# Altium schematic sheet RADIO.SchDoc
size A4; SheetNumber: 7; SheetTotal: 9
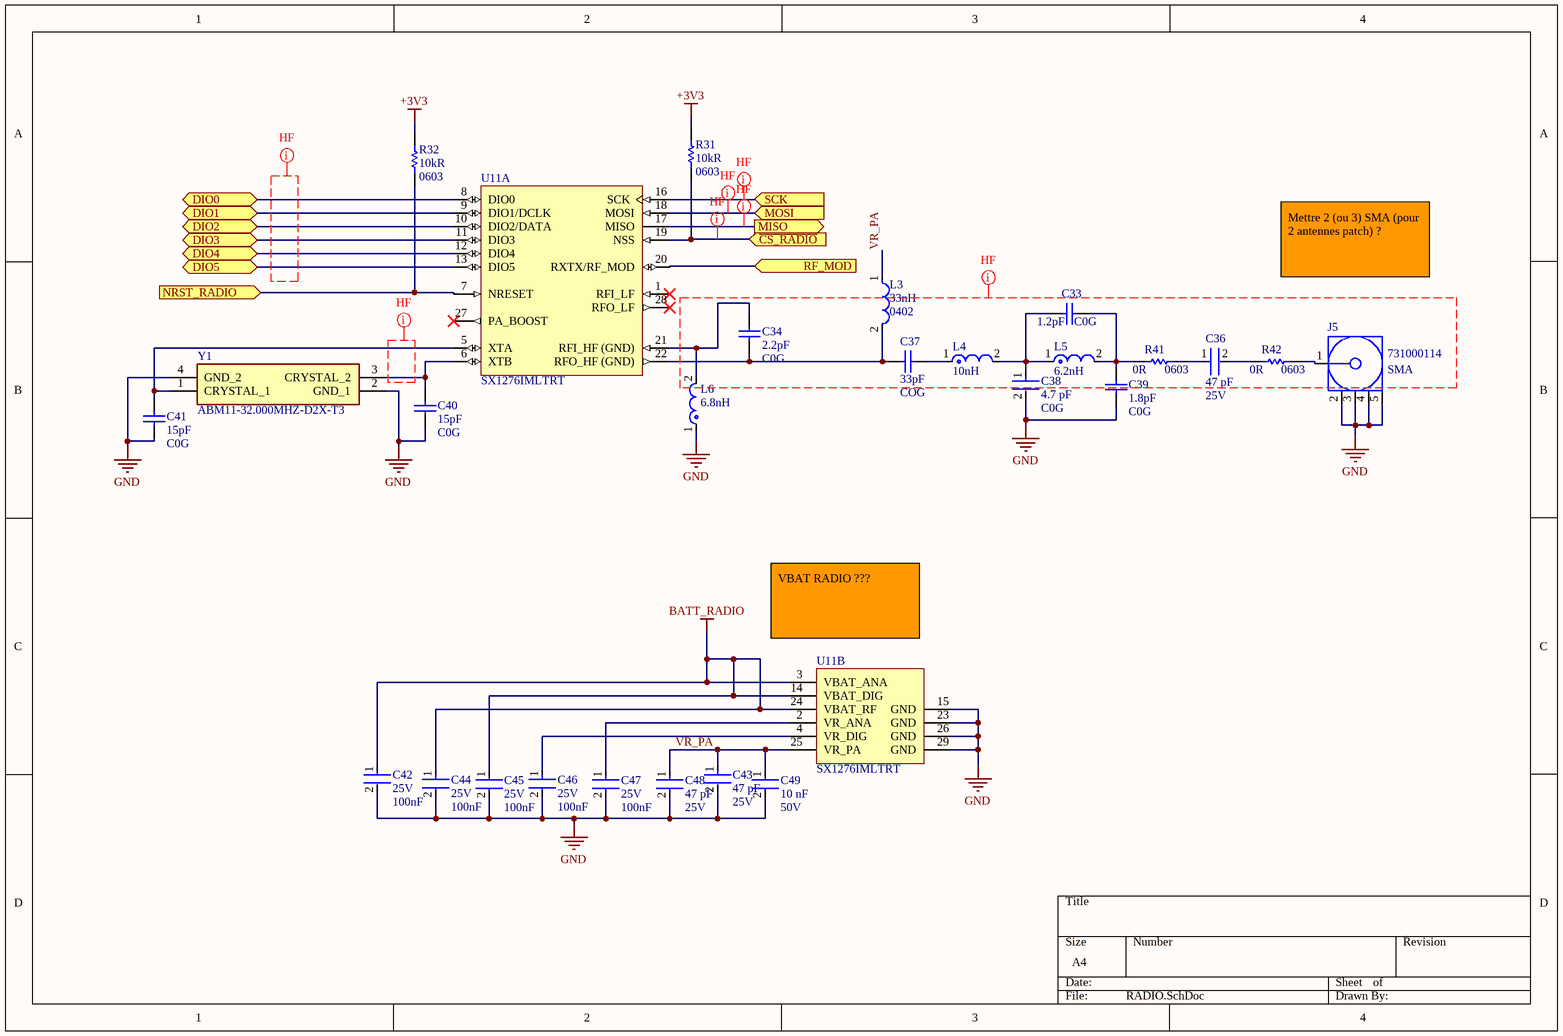
[diagram p0: RADIO.SchDoc]

## Parts
C33  Capacitance: 1.2pF  Dielectric: C0G  [CAPC1508X91X25LL25T13]  (hidden comment: 06032U1R2BAT2A)
C34  Capacitance: 2.2pF  Dielectric: C0G  [CAPC1005X56X25ML10T15]  (hidden comment: 04023A2R2CAT2A)
C36  Capacitance: 47 pF  Voltage Rating (DC): 25V  [FP-C0603C-CF-MFG]  (hidden comment: C0603C470J3GACTU)
C37  Capacitance: 33pF  Temperature Coefficient: COG  [CAPC1608X90X40LL10T20]  (hidden comment: CC0603JRNPO9BN330)
C38  Capacitance: 4.7 pF  Temperature Characteristic: C0G  [FP-C0603C-CF-MFG]  (hidden comment: C0603C479C5GACTU)
C39  Capacitance: 1.8pF  Dielectric: C0G  [CAPC1508X91X25NL25T13]  (hidden comment: 06032U1R8BAT2A)
C40  Capacitance: 15pF  Dielectric: C0G  [CAPC1608X92X38ML15T08]  (hidden comment: VJ0603D150JXPAJ)
C41  Capacitance: 15pF  Dielectric: C0G  [CAPC1608X92X38ML15T08]  (hidden comment: VJ0603D150JXPAJ)
C42  Voltage Rating (DC): 25V  Capacitance: 100nF  [FP-CGA3E-0_3-0_1-MFG]  (hidden comment: CGA3E2X7R1E104K080AA)
C43  Capacitance: 47 pF  Voltage Rating (DC): 25V  [FP-C0603C-CF-MFG]  (hidden comment: C0603C470J3GACTU)
C44  Voltage Rating (DC): 25V  Capacitance: 100nF  [FP-CGA3E-0_3-0_1-MFG]  (hidden comment: CGA3E2X7R1E104K080AA)
C45  Voltage Rating (DC): 25V  Capacitance: 100nF  [FP-CGA3E-0_3-0_1-MFG]  (hidden comment: CGA3E2X7R1E104K080AA)
C46  Voltage Rating (DC): 25V  Capacitance: 100nF  [FP-CGA3E-0_3-0_1-MFG]  (hidden comment: CGA3E2X7R1E104K080AA)
C47  Voltage Rating (DC): 25V  Capacitance: 100nF  [FP-CGA3E-0_3-0_1-MFG]  (hidden comment: CGA3E2X7R1E104K080AA)
C48  Capacitance: 47 pF  Voltage Rating (DC): 25V  [FP-C0603C-CF-MFG]  (hidden comment: C0603C470J3GACTU)
C49  Capacitance: 10 nF  Voltage Rating (DC): 50V  [FP-CC0603-DA-MFG]  (hidden comment: CC0603KRX7R9BB103)
J5  731000114  Case/Package: SMA  [MOLX-731000114_V]
L3  Inductance: 33nH  Case/Package: 0402  [FP-LQW15AN_00-W0_5-0_1-MFG]  (hidden comment: LQW15AN33NJ00D)
L4  Inductance: 10nH  [FP-LQG15HH_02-IPC_A]  (hidden comment: LQG15HS10NJ02D)
L5  Inductance: 6.2nH  [FP-LQG15HH_02-IPC_C]  (hidden comment: LQG15HS6N2S02D)
L6  Inductance: 6.8nH  [FP-LQG15HH_02-IPC_A]  (hidden comment: LQG15HS6N8J02D)
R31  Resistance: 10kR  Case Code (Imperial): 0603  [RESC1609X55X30LL15T15]  (hidden comment: ERJ3EKF1002V)
R32  Resistance: 10kR  Case Code (Imperial): 0603  [RESC1609X55X30LL15T15]  (hidden comment: ERJ3EKF1002V)
R41  Case Code (Imperial): 0603  Resistance: 0R  [RESC1608X55X25ML10T15]  (hidden comment: RC0603JR-070RL)
R42  Case Code (Imperial): 0603  Resistance: 0R  [RESC1608X55X25ML10T15]  (hidden comment: RC0603JR-070RL)
U11  SX1276IMLTRT  [SMTC-QFN-28_V]  (parts A,B of 2)
Y1  ABM11-32.000MHZ-D2X-T3  [ABM1132000MHZD2XT3]

## Ports
DIO0 (bidir), DIO1 (bidir), DIO2 (bidir), DIO3 (bidir), DIO4 (bidir), DIO5 (bidir), MISO (out), MOSI (in), NRST_RADIO (in), RF_MOD (in), SCK (in), ~{CS_RADIO} (in)

## Nets
+3V3: R31.2 R32.2
BATT_RADIO: C42.1 C44.1 C45.1 U11.3(VBAT_ANA) U11.14(VBAT_DIG) U11.24(VBAT_RF)
GND: C38.2 C39.1 C40.1 C41.1 C42.2 C43.2 C44.2 C45.2 C46.2 C47.2 C48.2 C49.2 J5.2 J5.3 J5.4 J5.5 L6.1 U11.15(GND) U11.23(GND) U11.26(GND) U11.29(GND) Y1.2(GND_1) Y1.4(GND_2)
~{CS_RADIO}: R31.1 U11.19(NSS) ; port ~{CS_RADIO}
DIO0: U11.8(DIO0) ; port DIO0
DIO1: U11.9(DIO1/DCLK) ; port DIO1
DIO2: U11.10(DIO2/DATA) ; port DIO2
DIO3: U11.11(DIO3) ; port DIO3
DIO4: U11.12(DIO4) ; port DIO4
DIO5: U11.13(DIO5) ; port DIO5
MISO: U11.17(MISO) ; port MISO
MOSI: U11.18(MOSI) ; port MOSI
NRST_RADIO: R32.1 U11.7(NRESET) ; port NRST_RADIO
RF_MOD: U11.20(RXTX/RF_MOD) ; port RF_MOD
SCK: U11.16(SCK) ; port SCK
VR_PA: C43.1 C48.1 C49.1 L3.1 U11.25(VR_PA)
NetC33_1: C33.1 C38.1 L4.2 L5.1
NetC33_2: C33.2 C39.2 L5.2 R41.1
NetC34_1: C34.1 L6.2 U11.21(RFI_HF_(GND))
NetC34_2: C34.2 C37.2 L3.2 U11.22(RFO_HF_(GND))
NetC36_1: C36.1 R41.2
NetC36_2: C36.2 R42.1
NetC37_1: C37.1 L4.1
NetC40_2: C40.2 U11.6(XTB) Y1.3(CRYSTAL_2)
NetC41_2: C41.2 U11.5(XTA) Y1.1(CRYSTAL_1)
NetC46_1: C46.1 U11.4(VR_DIG)
NetC47_1: C47.1 U11.2(VR_ANA)
NetJ5_1: J5.1 R42.2

Not connected (* = marked no-connect by the designer): U11 1(RFI_LF)* 27(PA_BOOST)* 28(RFO_LF)*

## Layout directives
net class HF: (no net found under the mark), MISO, MOSI, SCK, ~{CS_RADIO}

## Notes on the sheet
- Mettre 2 (ou 3) SMA (pour 2 antennes patch) ?
- (near U11) VBAT RADIO ???

## Library data of the parts
C33 = CMP-2006-04663-1: Manufacturer: AVX Interconnect / Elco; Dielectric Material: Ceramic; Voltage Rating: 200V; Temperature Coefficient: 30ppm/°C; Tolerance: 2%; Part Number: 06032U1R2BAT2A; Supplier 1: Mouser; Supplier Part Number 1: 581-06032U1R2BAT2A; Manufacturer Part Number: 06032U1R2BAT2A; RoHS: Yes; Category: Ceramic Capacitors; Stock 1: 554; Pricing 1: 1=0,38000, 10=0,26500, 50=0,26500, 100=0,15000, 500=0,11000, 1000=0,09700, 4000=0,08200, 8000=0,06700, 10000=0,06700 (USD); Mount: Surface Mount; Case/Package: 0603; Case Code (Imperial): 0603; Case Code (Metric): 1608; Contact Plating: Tin,Matte; Min Operating Temperature: -55°C; Max Operating Temperature: 125°C; Voltage Rating (DC): 200V; Packaging: Tape and Reel; Package Quantity: 4000; Termination: SMD/SMT; Series: U; Construction: Flat; Voltage: 200V; Resistor Type: Ceramic; Length: 1.52mm; Width: 0.81mm; Height: 0.91mm; Thickness: 0.036inch; Depth: 0.76mm; Radiation Hardening: No; RoHS Compliant: Yes; REACH SVHC: No SVHC; Lead Free: Lead Free; ComponentLink1URL: https://datasheet.ciiva.com/26939/getdatasheetpartid-777450-26939684.pdf?src-supplier=Verical; ComponentLink1Description: https://datasheet.ciiva.com/26939/getdatasheetpartid-777450-26939684.pdf?src-supplier=Verical; ComponentLink2URL: https://datasheet.ciiva.com/11787/0900766b80def273-11787231.pdf?src-supplier=RSComponents; ComponentLink2Description: https://datasheet.ciiva.com/11787/0900766b80def273-11787231.pdf?src-supplier=RSComponents; ComponentLink3URL: https://datasheet.ciiva.com/11573/useries-11573174.pdf?src-supplier=Avnet; ComponentLink3Description: https://datasheet.ciiva.com/11573/useries-11573174.pdf?src-supplier=Avnet; ComponentLink4URL: https://datasheet.ciiva.com/17489/useries-17489479.pdf?src-supplier=Avnet+Europe; ComponentLink4Description: https://datasheet.ciiva.com/17489/useries-17489479.pdf?src-supplier=Avnet+Europe; ComponentLink5URL: https://datasheet.ciiva.com/1124/319610-1124475.pdf?src-supplier=Element14; ComponentLink5Description: https://datasheet.ciiva.com/1124/319610-1124475.pdf?src-supplier=Element14; ComponentLink6URL: https://datasheet.ciiva.com/16327/useries-16327211.pdf?src-supplier=Future+Electronics; ComponentLink6Description: https://datasheet.ciiva.com/16327/useries-16327211.pdf?src-supplier=Future+Electronics; ComponentLink7URL: https://datasheet.ciiva.com/1124/319610-1124476.pdf?src-supplier=Element14; ComponentLink7Description: https://datasheet.ciiva.com/1124/319610-1124476.pdf?src-supplier=Element14; ComponentLink8URL: https://datasheet.ciiva.com/207/useries-207423.pdf?src-supplier=Digi-Key; ComponentLink8Description: https://datasheet.ciiva.com/207/useries-207423.pdf?src-supplier=Digi-Key
C34 = CMP-2008-02490-1: Manufacturer: AVX Interconnect / Elco; Voltage Rating: 25V; Part Number: 04023A2R2CAT2A; Supplier 1: Mouser; Supplier Part Number 1: 581-04023A2R2CAT2A; Manufacturer Part Number: 04023A2R2CAT2A; RoHS: Yes; Category: Ceramic Capacitors; Stock 1: 6118; Pricing 1: 1=0,32000, 10=0,22700, 50=0,22700, 100=0,12800, 1000=0,08700, 10000=0,05700 (USD); Mount: Surface Mount; Case/Package: 0402; Case Code (Metric): 1005; Case Code (Imperial): 0402; Min Operating Temperature: -55°C; Max Operating Temperature: 125°C; Packaging: Tape and Reel; Package Quantity: 10000; Voltage Rating (DC): 25V; Termination: SMD/SMT; Series: -; Construction: Flat; Length: 1mm; Width: 0.02inch; Thickness: 0.022inch; Depth: 0.5mm; Radiation Hardening: No; RoHS Compliant: Yes; Lead Free: Lead Free; ComponentLink1URL: https://datasheet.ciiva.com/206/ccog-206373.pdf?src-supplier=Digi-Key; ComponentLink1Description: https://datasheet.ciiva.com/206/ccog-206373.pdf?src-supplier=Digi-Key; ComponentLink2URL: https://datasheet.ciiva.com/5447/ccog-243403-5447334.pdf?src-supplier=Mouser; ComponentLink2Description: https://datasheet.ciiva.com/5447/ccog-243403-5447334.pdf?src-supplier=Mouser; ComponentLink3URL: https://datasheet.ciiva.com/11572/ccog-11572039.pdf?src-supplier=Avnet; ComponentLink3Description: https://datasheet.ciiva.com/11572/ccog-11572039.pdf?src-supplier=Avnet
C36 C43 C48 = CMP-2006-03632-2: CAP CER 47PF 25V 5% NP0 0603; Manufacturer: KEMET; Temperature Characteristic: C0G; Temperature Coefficient: 30ppm/°C; Automotive Grade: Grade 1; Material: Ceramic; Tolerance: 0.05; Dissipation Factor: 0.1%; Height: 0.87mm; Category: Cap; Value: 47 pF; Temperature Range Low: -55°C; ComponentLink2Description: Datasheet; Temperature: -55°C to +125°C; RoHS: TRUE; Device Class L2: Capacitors; Manufacturer Part Number: C0603C470J3GACTU; Device Class L1: Passive Components; Automotive: Yes; Digikey Description: CAP CER 47PF 25V 5% NP0 0603; Temperature Range High: +125°C; Package: C0603C-CF; Device Class L3: Ceramic Capacitors; Octopart: https://octopart.com/c0603c470j3gactu-kemet-8375742; Voltage Rating: 25 V; Lead Free: Yes; Mouser Description: Multilayer Ceramic Capacitors MLCC - SMD/SMT 25volts 47pF C0G 5%; ComponentLink2URL: https://api.kemet.com/component-edge/download/datasheet/C0603C100J5GACAUTO.pdf; Supplier 1: Mouser; Supplier Part Number 1: 80-C0603C470J3G; Stock 1: 20028; Pricing 1: 1=0,25000, 10=0,13100, 50=0,13100, 100=0,07800, 1000=0,06100, 10000=0,04800 (USD); Mount: Surface Mount; Case/Package: 0603; Case Code (Metric): 1608; Case Code (Imperial): 0603; Dielectric Material: Ceramic; Min Operating Temperature: -55°C; Max Operating Temperature: 125°C; Package Quantity: 1; Packaging: Tape and Reel; Dielectric: C0G; Termination: SMD/SMT; Series: C; Construction: Flat; Length: 1.6mm; Width: 0.031inch; Thickness: 0.034inch; Depth: 0.8mm; Lead Pitch: 0.7mm; Radiation Hardening: No; RoHS Compliant: Yes; REACH SVHC: No SVHC; ComponentLink1URL: https://datasheet.ciiva.com/5417/kem-c1003-c0g-smd-356956-5417785.pdf?src-supplier=Mouser; ComponentLink1Description: https://datasheet.ciiva.com/5417/kem-c1003-c0g-smd-356956-5417785.pdf?src-supplier=Mouser; ComponentLink3URL: https://datasheet.ciiva.com/11646/kem-c1003-c0g-smd-11646191.pdf?src-supplier=Avnet; ComponentLink3Description: https://datasheet.ciiva.com/11646/kem-c1003-c0g-smd-11646191.pdf?src-supplier=Avnet
C37 = CMP-2000-06072-1: Chip Capacitor, 33 pF, +/- 5%, 50 V, -55 to 125 degC, 0603 (1608 Metric), RoHS, Tape and Reel; Manufacturer: Yageo; Product Training Modules: MultilayerCeramicCapacitors; Voltage - Rated: 50V; Featured Product: CommodityMultilayerCeramicCapacitors–CCSeries; Other Names: 0603CG330J9B200223886715339223886715339311-1064-2311-1282-2311-1282-2-NDCC0603JRNP09BN330BCC0603JRNPO9BN330B; Online Catalog: CCSeries; Dielectric Material: Ceramic; Dielectric: C0G; Insulation Resistance: 100GR; Operating Temperature: -55°C~125°C; Thickness (Max): 0.035"(0.90mm); Size / Dimension: 0.063"Lx0.031"W(1.60mmx0.80mm); Lead Spacing: -; Mounting Type: SurfaceMount,MLCC; Tolerance: ±5%; Standard Package: 4,000; Mounting Technology: SurfaceMount; Ratings: -; Applications: GeneralPurpose; Height - Seated (Max): -; Packaging: Tape&Reel(TR); Series: CC; Package / Case: 0603(1608Metric); Package Description: 2-Pin Surface Mount Device, Body 1.6 x 0.8 mm; Manufacturer URL: http://www.yageo.com/; Family: CeramicCapacitors; Package Reference: 0603; Category: Capacitors; Datasheet Version: Rev. 14, 07/2016; Datasheet URL: http://www.yageo.com/NewPortal/yageodocoutput?fileName=/pdf/MLCC/UPY-GP_NP0_16V-to-50V_14.pdf; Features: -; Lead Style: -; Supplier 1: Mouser; Supplier Part Number 1: 603-C0603JRNPO9BN330; Manufacturer Part Number: CC0603JRNPO9BN330; RoHS: Yes; Stock 1: 34053; Pricing 1: 1=0,10000, 10=0,05700, 50=0,05700, 100=0,02500, 500=0,01900, 1000=0,01500, 4000=0,01200, 8000=0,01000, 10000=0,01000 (USD); Mount: Surface Mount; Case/Package: 0603; Number of Pins: 2; Case Code (Metric): 1608; Case Code (Imperial): 0603; Min Operating Temperature: -55°C; Max Operating Temperature: 125°C; Voltage Rating: 50V; Package Quantity: 1; Voltage Rating (DC): 50V; Termination: SMD/SMT; Voltage: 50V; Resistor Type: Ceramic; Length: 1.6mm; Width: 0.031inch; Height: 0.8mm; Thickness: 0.035inch; Depth: 0.8mm; Radiation Hardening: No; REACH SVHC: No SVHC; Lead Free: Lead Free; RoHS Compliant: Yes; ComponentLink1URL: https://datasheet.ciiva.com/11786/0900766b8079c870-11786082.pdf?src-supplier=RSComponents; ComponentLink1Description: https://datasheet.ciiva.com/11786/0900766b8079c870-11786082.pdf?src-supplier=RSComponents; ComponentLink2URL: https://datasheet.ciiva.com/26862/getdatasheetpartid-403532-26862767.pdf?src-supplier=Verical; ComponentLink2Description: https://datasheet.ciiva.com/26862/getdatasheetpartid-403532-26862767.pdf?src-supplier=Verical; ComponentLink3URL: https://datasheet.ciiva.com/144/mlccorderingcode-144643.pdf?src-supplier=Digi-Key; ComponentLink3Description: https://datasheet.ciiva.com/144/mlccorderingcode-144643.pdf?src-supplier=Digi-Key; ComponentLink4URL: https://datasheet.ciiva.com/144/mlccorderingcode-144644.pdf?src-supplier=Digi-Key; ComponentLink4Description: https://datasheet.ciiva.com/144/mlccorderingcode-144644.pdf?src-supplier=Digi-Key; ComponentLink5URL: https://datasheet.ciiva.com/144/mlccorderingcode-144645.pdf?src-supplier=Digi-Key; ComponentLink5Description: https://datasheet.ciiva.com/144/mlccorderingcode-144645.pdf?src-supplier=Digi-Key; ComponentLink6URL: https://datasheet.ciiva.com/5426/upy-gp-np0-16v-to-50v-8-5426614.pdf?src-supplier=Mouser; ComponentLink6Description: https://datasheet.ciiva.com/5426/upy-gp-np0-16v-to-50v-8-5426614.pdf?src-supplier=Mouser; ComponentLink7URL: https://datasheet.ciiva.com/8033/1372269-8033734.pdf?src-supplier=Element14; ComponentLink7Description: https://datasheet.ciiva.com/8033/1372269-8033734.pdf?src-supplier=Element14; ComponentLink8URL: https://datasheet.ciiva.com/8033/1443161-8033735.pdf?src-supplier=Element14; ComponentLink8Description: https://datasheet.ciiva.com/8033/1443161-8033735.pdf?src-supplier=Element14; ComponentLink9URL: https://datasheet.ciiva.com/11464/upy-gp-np0-16v-to-50v-8-11464730.pdf?src-supplier=Avnet; ComponentLink9Description: https://datasheet.ciiva.com/11464/upy-gp-np0-16v-to-50v-8-11464730.pdf?src-supplier=Avnet; ComponentLink10URL: https://datasheet.ciiva.com/46430/1835847-46430155.pdf?src-supplier=Element14; ComponentLink10Description: https://datasheet.ciiva.com/46430/1835847-46430155.pdf?src-supplier=Element14; ComponentLink11URL: https://datasheet.ciiva.com/7978/1443161-7978142.pdf?src-supplier=Element14; ComponentLink11Description: https://datasheet.ciiva.com/7978/1443161-7978142.pdf?src-supplier=Element14
C38 = CMP-2006-03239-2: CAP CER 4.7PF 50V NP0 0603; Manufacturer: KEMET; Material: Ceramic; Tolerance: 0.25 pF; Automotive Grade: Grade 1; Temperature Coefficient: 30ppm/°C; Mouser Description: Multilayer Ceramic Capacitors MLCC - SMD/SMT 50volts 4.7pF C0G 0.25%; Octopart: https://octopart.com/c0603c479c5gactu-kemet-3648287; ComponentLink2URL: https://api.kemet.com/component-edge/download/datasheet/C0603C100J5GACAUTO.pdf; Temperature Range High: +125°C; Digikey Description: CAP CER 4.7PF 50V NP0 0603; Voltage Rating: 50 V; Automotive: Yes; Device Class L3: Ceramic Capacitors; Manufacturer Part Number: C0603C479C5GACTU; Height: 0.87mm; Temperature: -55°C to +125°C; RoHS: TRUE; Device Class L1: Passive Components; Temperature Range Low: -55°C; Lead Free: Yes; Device Class L2: Capacitors; Package: C0603C-CF; ComponentLink2Description: Datasheet; Value: 4.7 pF; Category: Cap; Supplier 1: Mouser; Supplier Part Number 1: 80-C0603C479C5G; Stock 1: 25651; Pricing 1: 1=0,38000, 10=0,21400, 50=0,21400, 100=0,13700, 500=0,11800, 1000=0,10600, 4000=0,07800, 10000=0,07800 (USD); Mount: Surface Mount; Case/Package: 0603; Number of Pins: 2; Case Code (Metric): 1608; Case Code (Imperial): 0603; Dielectric Material: Ceramic; Contact Plating: Tin,Matte; Min Operating Temperature: -55°C; Max Operating Temperature: 125°C; Package Quantity: 1; Packaging: Tape and Reel; Dielectric: C0G; Termination: SMD/SMT; Series: C; Construction: Flat; Voltage Rating (DC): 50V; Voltage: 50V; Length: 1.6mm; Width: 0.031inch; Depth: 0.8mm; Thickness: 0.034inch; Lead Pitch: 0.7mm; Radiation Hardening: No; REACH SVHC: No SVHC; RoHS Compliant: Yes; ComponentLink1URL: https://datasheet.ciiva.com/16623/datasheetpn-c0603c479c5gac7867-16623650.pdf?src-supplier=Avnet+Europe; ComponentLink1Description: https://datasheet.ciiva.com/16623/datasheetpn-c0603c479c5gac7867-16623650.pdf?src-supplier=Avnet+Europe; ComponentLink3URL: https://datasheet.ciiva.com/7823/40889-7823813.pdf?src-supplier=Element14; ComponentLink3Description: https://datasheet.ciiva.com/7823/40889-7823813.pdf?src-supplier=Element14; ComponentLink4URL: https://datasheet.ciiva.com/5422/kem-c1003-c0g-smd-5422091.pdf?src-supplier=Mouser; ComponentLink4Description: https://datasheet.ciiva.com/5422/kem-c1003-c0g-smd-5422091.pdf?src-supplier=Mouser
C39 = CMP-2006-04666-1: Manufacturer: AVX Interconnect / Elco; Dielectric Material: Ceramic; Voltage Rating: 200V; Temperature Coefficient: 30ppm/°C; Part Number: 06032U1R8BAT2A; Supplier 1: Mouser; Supplier Part Number 1: 581-06032U1R8B; Manufacturer Part Number: 06032U1R8BAT2A; RoHS: Yes; Category: Ceramic Capacitors; Stock 1: 3809; Pricing 1: 1=0,35000, 10=0,24000, 50=0,24000, 100=0,13600, 500=0,09600, 1000=0,08400, 4000=0,07400, 8000=0,06100, 10000=0,06100 (USD); Mount: Surface Mount; Case/Package: 0603; Case Code (Metric): 1608; Case Code (Imperial): 0603; Contact Plating: Tin,Matte; Min Operating Temperature: -55°C; Max Operating Temperature: 125°C; Package Quantity: 8000; Packaging: Tape and Reel; Series: U; Voltage Rating (DC): 200V; Termination: SMD/SMT; Voltage: 200V; Construction: Flat; Resistor Type: Ceramic; Length: 1.52mm; Width: 0.03inch; Height: 2.03mm; Thickness: 0.036inch; Depth: 0.76mm; Radiation Hardening: No; RoHS Compliant: Yes; REACH SVHC: No SVHC; Lead Free: Lead Free; ComponentLink1URL: https://datasheet.ciiva.com/11786/0900766b80def273-11786574.pdf?src-supplier=RSComponents; ComponentLink1Description: https://datasheet.ciiva.com/11786/0900766b80def273-11786574.pdf?src-supplier=RSComponents; ComponentLink2URL: https://datasheet.ciiva.com/1124/319610-1124480.pdf?src-supplier=Element14; ComponentLink2Description: https://datasheet.ciiva.com/1124/319610-1124480.pdf?src-supplier=Element14; ComponentLink3URL: https://datasheet.ciiva.com/207/useries-207428.pdf?src-supplier=Digi-Key; ComponentLink3Description: https://datasheet.ciiva.com/207/useries-207428.pdf?src-supplier=Digi-Key; ComponentLink4URL: https://datasheet.ciiva.com/11572/useries-11572647.pdf?src-supplier=Avnet; ComponentLink4Description: https://datasheet.ciiva.com/11572/useries-11572647.pdf?src-supplier=Avnet; ComponentLink5URL: https://datasheet.ciiva.com/17489/useries-17489483.pdf?src-supplier=Avnet+Europe; ComponentLink5Description: https://datasheet.ciiva.com/17489/useries-17489483.pdf?src-supplier=Avnet+Europe; ComponentLink6URL: https://datasheet.ciiva.com/16327/useries-16327213.pdf?src-supplier=Future+Electronics; ComponentLink6Description: https://datasheet.ciiva.com/16327/useries-16327213.pdf?src-supplier=Future+Electronics; ComponentLink7URL: https://datasheet.ciiva.com/1124/319610-1124479.pdf?src-supplier=Element14; ComponentLink7Description: https://datasheet.ciiva.com/1124/319610-1124479.pdf?src-supplier=Element14
C40 C41 = CMP-2006-01493-1: Manufacturer: Vitramon; Voltage Rating: 250V; Tolerance: 5%; Temperature Coefficient: 30ppm/°C; Part Number: VJ0603D150JXPAJ; Supplier 1: Mouser; Supplier Part Number 1: 77-VJ0603D150JXPAJ; Manufacturer Part Number: VJ0603D150JXPAJ; RoHS: Yes; Category: Ceramic Capacitors; Stock 1: 8975; Pricing 1: 1=0,36000, 10=0,25100, 50=0,25100, 100=0,15100, 1000=0,09500, 10000=0,09500 (USD); Mount: Surface Mount,PCB; Case/Package: 0603; Case Code (Imperial): 0603; Case Code (Metric): 1608; Min Operating Temperature: -55°C; Max Operating Temperature: 125°C; Packaging: Tape and Reel; Package Quantity: 1; Voltage Rating (DC): 250V; Voltage: 250V; Termination: SMD/SMT; Series: VJ HIFREQ; Construction: Flat; Length: 1.6mm; Width: 0.8mm; Height: 0.92mm; Thickness: 0.037inch; Depth: 0.8mm; Radiation Hardening: No; Lead Free: Lead Free; RoHS Compliant: Yes; REACH SVHC: Unknown; ComponentLink1URL: https://datasheet.ciiva.com/30503/0900766b812428e7-30503866.pdf?src-supplier=RSComponents; ComponentLink1Description: https://datasheet.ciiva.com/30503/0900766b812428e7-30503866.pdf?src-supplier=RSComponents; ComponentLink2URL: https://datasheet.ciiva.com/11484/vjhifreq-11484678.pdf?src-supplier=Avnet; ComponentLink2Description: https://datasheet.ciiva.com/11484/vjhifreq-11484678.pdf?src-supplier=Avnet; ComponentLink3URL: https://datasheet.ciiva.com/16511/vj0402dseries-16511368.pdf?src-supplier=Future+Electronics; ComponentLink3Description: https://datasheet.ciiva.com/16511/vj0402dseries-16511368.pdf?src-supplier=Future+Electronics; ComponentLink4URL: https://datasheet.ciiva.com/6252/vjhifreq-6252938.pdf?src-supplier=Digi-Key; ComponentLink4Description: https://datasheet.ciiva.com/6252/vjhifreq-6252938.pdf?src-supplier=Digi-Key; ComponentLink5URL: https://datasheet.ciiva.com/6252/vjhifreq-6252941.pdf?src-supplier=Digi-Key; ComponentLink5Description: https://datasheet.ciiva.com/6252/vjhifreq-6252941.pdf?src-supplier=Digi-Key
C42 C44-C47 = CMP-08246-002186-1: Cap Ceramic 100nF 25V X7R 10% Pad SMD 0603 +125°C Automotive T/R; Manufacturer: TDK; Composition: Ceramic; Dielectric: X7R; Ratings: AEC-Q200; Length: 1.6mm; REACH SVHC: No SVHC; Width: 0.031inch; Packaging: Tape and Reel; Case/Package: 0603; Height: 0.8mm; Termination: SMD/SMT; Max Operating Temperature: 125°C; Thickness: 0.035inch; Case Code (Metric): 1608; Lead Free: Lead Free; Mount: Surface Mount; Voltage Rating: 25V; Tolerance: 10%; Weight: 7.1E-05oz; Min Operating Temperature: -55°C; Package Quantity: 1; Depth: 0.8mm; Case Code (Imperial): 0603; Supplier 1: Mouser; Supplier Part Number 1: 810-CGA3E2X7R1E104K; Manufacturer Part Number: CGA3E2X7R1E104K080AA; RoHS: Yes; Category: Ceramic Capacitors; Stock 1: 488891; Pricing 1: 1=0,12000, 10=0,05600, 50=0,05600, 100=0,02500, 1000=0,01400, 10000=0,01000 (USD); Series: CGA; Resistor Type: Ceramic; RoHS Compliant: Yes; ComponentLink1URL: https://datasheet.ciiva.com/24220/cga3e2x7r1e104k080aa-265934-24220022.pdf?src-supplier=Mouser; ComponentLink1Description: https://datasheet.ciiva.com/24220/cga3e2x7r1e104k080aa-265934-24220022.pdf?src-supplier=Mouser; ComponentLink2URL: https://datasheet.ciiva.com/22725/1735392-22725638.pdf?src-supplier=Element14; ComponentLink2Description: https://datasheet.ciiva.com/22725/1735392-22725638.pdf?src-supplier=Element14; ComponentLink3URL: https://datasheet.ciiva.com/22725/1735392-22725639.pdf?src-supplier=Element14; ComponentLink3Description: https://datasheet.ciiva.com/22725/1735392-22725639.pdf?src-supplier=Element14; ComponentLink4URL: https://datasheet.ciiva.com/16427/mlccspec-automotive-general-midvoltage-en-16427320.pdf?src-supplier=Future+Electronics; ComponentLink4Description: https://datasheet.ciiva.com/16427/mlccspec-automotive-general-midvoltage-en-16427320.pdf?src-supplier=Future+Electronics; ComponentLink5URL: https://datasheet.ciiva.com/23803/1735392-23803082.pdf?src-supplier=Newark; ComponentLink5Description: https://datasheet.ciiva.com/23803/1735392-23803082.pdf?src-supplier=Newark
C49 = CMP-2100-03600-2: CAP CER 10000PF 50V X7R 0603; Manufacturer: YAGEO; Tolerance: 0.1; Material: Ceramic; Temperature Coefficient: 15%; Value: 10 nF; Insulation Resistance: 100GR; Mouser Description: Multilayer Ceramic Capacitor, CC Series, 0.01 - F, - 10%, X7R, 50 V, 0603 [1608 Metric]; Digikey Description: CAP CER 10000PF 50V X7R 0603; Height: 0.9mm; Category: Cap; Temperature Characteristic: X7R; Footprint Url: http://www.yageo.com/exep/pages/download/literatures/UPY-C_GEN_24.pdf; Lead Free: Yes; Voltage Rating: 50 V; Manufacturer Part Number: CC0603KRX7R9BB103; Temperature: -55°C to +125°C; Device Class L3: Ceramic Capacitors; ComponentLink2Description: Datasheet; Voltage: 50 V; Package: CC0603-DA; Octopart: https://octopart.com/cc0603krx7r9bb103-yageo-192938; Automotive: No; Temperature Range High: +125°C; Temperature Range Low: -55°C; RoHS: TRUE; Device Class L1: Passive Components; ComponentLink2URL: http://www.yageo.com/documents/recent/UPY-GPHC_X7R_6.3V-to-50V_18.pdf; Device Class L2: Capacitors; Supplier 1: Mouser; Supplier Part Number 1: 603-CC603KRX7R9BB103; Stock 1: 73824; Pricing 1: 1=0,10000, 10=0,05300, 50=0,05300, 100=0,02400, 500=0,01700, 1000=0,01300, 2000=0,01200, 4000=0,01100, 8000=0,00900, 10000=0,00900 (USD); Mount: Surface Mount; Case/Package: 0603; Number of Pins: 2; Case Code (Metric): 1608; Case Code (Imperial): 0603; Min Operating Temperature: -55°C; Max Operating Temperature: 125°C; Packaging: Tape and Reel; Dielectric: X7R; Termination: SMD/SMT; Package Quantity: 1; Series: CC; Resistor Type: Ceramic; Length: 1.6mm; Width: 0.031inch; Thickness: 0.035inch; Depth: 0.8mm; Radiation Hardening: No; REACH SVHC: No SVHC; RoHS Compliant: Yes; Halogen Free: Halogen Free; ComponentLink1URL: https://datasheet.ciiva.com/11788/0900766b8079c870-11788374.pdf?src-supplier=RSComponents; ComponentLink1Description: https://datasheet.ciiva.com/11788/0900766b8079c870-11788374.pdf?src-supplier=RSComponents; ComponentLink3URL: https://datasheet.ciiva.com/26862/getdatasheetpartid-403582-26862846.pdf?src-supplier=Verical; ComponentLink3Description: https://datasheet.ciiva.com/26862/getdatasheetpartid-403582-26862846.pdf?src-supplier=Verical; ComponentLink4URL: https://datasheet.ciiva.com/8033/1734573-8033861.pdf?src-supplier=Element14; ComponentLink4Description: https://datasheet.ciiva.com/8033/1734573-8033861.pdf?src-supplier=Element14; ComponentLink5URL: https://datasheet.ciiva.com/176/mlccorderingcode-176550.pdf?src-supplier=Digi-Key; ComponentLink5Description: https://datasheet.ciiva.com/176/mlccorderingcode-176550.pdf?src-supplier=Digi-Key; ComponentLink6URL: https://datasheet.ciiva.com/176/mlccorderingcode-176551.pdf?src-supplier=Digi-Key; ComponentLink6Description: https://datasheet.ciiva.com/176/mlccorderingcode-176551.pdf?src-supplier=Digi-Key; ComponentLink7URL: https://datasheet.ciiva.com/13389/upy-gphc-x7r-6-3v-to-50v-8-13389991.pdf?src-supplier=Mouser; ComponentLink7Description: https://datasheet.ciiva.com/13389/upy-gphc-x7r-6-3v-to-50v-8-13389991.pdf?src-supplier=Mouser; ComponentLink8URL: https://datasheet.ciiva.com/176/mlccorderingcode-176552.pdf?src-supplier=Digi-Key; ComponentLink8Description: https://datasheet.ciiva.com/176/mlccorderingcode-176552.pdf?src-supplier=Digi-Key; ComponentLink9URL: https://datasheet.ciiva.com/8033/1734573-8033816.pdf?src-supplier=Element14; ComponentLink9Description: https://datasheet.ciiva.com/8033/1734573-8033816.pdf?src-supplier=Element14; ComponentLink10URL: https://datasheet.ciiva.com/8033/70765-8033817.pdf?src-supplier=Element14; ComponentLink10Description: https://datasheet.ciiva.com/8033/70765-8033817.pdf?src-supplier=Element14; ComponentLink11URL: https://datasheet.ciiva.com/16625/upy-gphc-x7r-6-3v-to-50v-8-16625529.pdf?src-supplier=Avnet+Europe; ComponentLink11Description: https://datasheet.ciiva.com/16625/upy-gphc-x7r-6-3v-to-50v-8-16625529.pdf?src-supplier=Avnet+Europe; ComponentLink12URL: https://datasheet.ciiva.com/28450/1489800-28450619.pdf?src-supplier=Element14; ComponentLink12Description: https://datasheet.ciiva.com/28450/1489800-28450619.pdf?src-supplier=Element14
J5 = CMP-2000-05487-1: SMA Right-Angle PCB Jack Receptacle, Brass Body, Gold Plated, 50 Ohm, 5-Pin THD, RoHS, Tray; Manufacturer: Molex; Manufacturer Part Number: 73100-0114; Dielectric Material: PTFE; Polarity: Normal; Impedance: 50R; Connector Type: SMA,PCB,Coaxial; Gender: Female; Frequency: 12Hz; Max Frequency: 18GHz; Voltage Rating: 500V; Operating Frequency: 0 to 12 GHz; Datasheet Version: 09/2016; Package Description: 5-Pin Through Hole Device, Body 14.8 x 6.35 mm, Pitch 2.54 mm; Datasheet URL: http://www.molex.com/webdocs/datasheets/pdf/en-us/0731000114_RF_COAX_CONNECTORS.pdf; Manufacturer URL: http://www.molex.com/; Package Reference: 731000114; Mounting Technology: ThroughHole; Package URL: http://www.molex.com/pdm_docs/sd/731000114_sd.pdf; Supplier 1: Mouser; Supplier Part Number 1: 538-73100-0114; RoHS: Yes; Category: RF / Coaxial Connectors; Stock 1: 639; Pricing 1: 1=5,69000, 10=5,01000, 50=5,01000, 100=3,99000, 500=3,88000, 1000=3,31000, 2500=3,07000, 5000=2,95000, 10000=2,84000 (USD); Mount: Through Hole; Contact Plating: Gold; Contact Material: Copper; Body Material: Brass; Body Plating: Gold; Insulation Material: Teflon; Housing Color: Gold; Plating: Gold; Center Contact Plating: Gold; Min Operating Temperature: -65°C; Max Operating Temperature: 165°C; Package Quantity: 1760; Packaging: Tray; Series: 73100; Termination: Solder; Orientation: Right Angle; Fastening Type: Threaded; Length: 14.8mm; Radiation Hardening: No; REACH SVHC: Unknown; ComponentLink1URL: https://datasheet.ciiva.com/7996/1596725-7996452.pdf?src-supplier=Element14; ComponentLink1Description: https://datasheet.ciiva.com/7996/1596725-7996452.pdf?src-supplier=Element14; ComponentLink2URL: https://datasheet.ciiva.com/30104/82220731000114-rf-coax-nectors-30104097.pdf?src-supplier=Onlinecomponents.com; ComponentLink2Description: https://datasheet.ciiva.com/30104/82220731000114-rf-coax-nectors-30104097.pdf?src-supplier=Onlinecomponents.com; ComponentLink3URL: https://datasheet.ciiva.com/26945/getdatasheetpartid-152702-26945396.pdf?src-supplier=Verical; ComponentLink3Description: https://datasheet.ciiva.com/26945/getdatasheetpartid-152702-26945396.pdf?src-supplier=Verical
L3 = CMP-06042-007456-1: Wire Wound RF Inductor 33nH ±5% 260mA 0.63Ω 0402 (1005); Manufacturer: Murata; Test Frequency: 100MHz; Core Material: Air; Shielding: Unshielded; Q Factor: 25; Self Resonant Frequency: 3.2GHz; DC Resistance (DCR): 630mR; Width: 0.5mm; Tolerance: 5%; Case Code (Imperial): 0402; Max Operating Temperature: 125°C; Weight: 2.8E-05oz; Case Code (Metric): 1005; Lead Free: Lead Free; Max DC Current: 260mA; Military Standard: Not; Length: 1mm; Packaging: Tape and Reel; Mount: Surface Mount; Package Quantity: 10000; Min Operating Temperature: -55°C; Resistor Type: Wirewound; Radiation Hardening: No; Height: 0.5mm; Termination: SMD/SMT; DC Current: 260mA; Current Rating: 260mA; Depth: 0.6mm; Supplier 1: Mouser; Supplier Part Number 1: 81-LQW15AN33NJ00D; Manufacturer Part Number: LQW15AN33NJ00D; RoHS: Yes; Category: Fixed Inductors; Stock 1: 27628; Pricing 1: 1=0,16000, 10=0,11300, 50=0,11300, 100=0,09100, 500=0,07900, 1000=0,06700, 2500=0,05700, 5000=0,05400, 10000=0,05000, 20000=0,04400 (USD); Series: LQW15A_00; Rated Current-Max: 260mA; RoHS Compliant: Yes; ComponentLink1URL: https://datasheet.ciiva.com/11799/0900766b8090d800-11799092.pdf?src-supplier=RSComponents; ComponentLink1Description: https://datasheet.ciiva.com/11799/0900766b8090d800-11799092.pdf?src-supplier=RSComponents; ComponentLink2URL: https://datasheet.ciiva.com/8510/l0075s0080lqw15a-00-8510437.pdf?src-supplier=Avnet; ComponentLink2Description: https://datasheet.ciiva.com/8510/l0075s0080lqw15a-00-8510437.pdf?src-supplier=Avnet; ComponentLink3URL: https://datasheet.ciiva.com/1042/l0075s0080lqw15a-00-1042187.pdf?src-supplier=Digi-Key; ComponentLink3Description: https://datasheet.ciiva.com/1042/l0075s0080lqw15a-00-1042187.pdf?src-supplier=Digi-Key; ComponentLink4URL: https://datasheet.ciiva.com/17278/l0075s0080lqw15a-00-17278475.pdf?src-supplier=Avnet+Europe; ComponentLink4Description: https://datasheet.ciiva.com/17278/l0075s0080lqw15a-00-17278475.pdf?src-supplier=Avnet+Europe; ComponentLink5URL: https://datasheet.ciiva.com/18089/getdatasheetpartid-153204-18089703.pdf?src-supplier=Verical; ComponentLink5Description: https://datasheet.ciiva.com/18089/getdatasheetpartid-153204-18089703.pdf?src-supplier=Verical; ComponentLink6URL: https://datasheet.ciiva.com/1042/l0075s0080lqw15a-00-1042186.pdf?src-supplier=Digi-Key; ComponentLink6Description: https://datasheet.ciiva.com/1042/l0075s0080lqw15a-00-1042186.pdf?src-supplier=Digi-Key; ComponentLink7URL: https://datasheet.ciiva.com/16455/l0075s0080lqw15a-00-16455914.pdf?src-supplier=Future+Electronics; ComponentLink7Description: https://datasheet.ciiva.com/16455/l0075s0080lqw15a-00-16455914.pdf?src-supplier=Future+Electronics; ComponentLink8URL: https://datasheet.ciiva.com/1042/l0075s0080lqw15a-00-1042188.pdf?src-supplier=Digi-Key; ComponentLink8Description: https://datasheet.ciiva.com/1042/l0075s0080lqw15a-00-1042188.pdf?src-supplier=Digi-Key
L4 = CMP-06042-014117-1: Multilayer type RF Inductor 10nH ±5% 0.26Ω 500mA 0402; Manufacturer: Murata; DC Resistance (DCR): 260mR; DC Current: 300mA; Shielding: Unshielded; Q Factor: 8; Test Frequency: 100MHz; Self Resonant Frequency: 3.4GHz; Core Material: Air; Width: 0.5mm; Radiation Hardening: No; Packaging: Tape and Reel; Lead Free: Lead Free; Military Standard: Not; Case/Package: 0402; Current Rating: 300mA; Case Code (Metric): 1005; Length: 0.039inch; Termination: SMD/SMT; Max DC Current: 300mA; Max Operating Temperature: 125°C; Mount: Surface Mount; Height - Seated (Max): 0.022inch; Package Quantity: 10000; Height: 0.5mm; Tolerance: 5%; Case Code (Imperial): 0402; Depth: 0.55mm; Min Operating Temperature: -55°C; Supplier 1: Mouser; Supplier Part Number 1: 81-LQG15HS10NJ02D; Manufacturer Part Number: LQG15HS10NJ02D; RoHS: Yes; Category: Fixed Inductors; Stock 1: 97891; Pricing 1: 1=0,10000, 10=0,06100, 50=0,06100, 100=0,04000, 500=0,03400, 1000=0,02800, 2500=0,02300, 5000=0,02100, 10000=0,01900 (USD); Series: LQG15HS; Rated Current-Max: 300mA; RoHS Compliant: Yes; ComponentLink1URL: https://datasheet.ciiva.com/11801/0900766b80f10809-11801401.pdf?src-supplier=RSComponents; ComponentLink1Description: https://datasheet.ciiva.com/11801/0900766b80f10809-11801401.pdf?src-supplier=RSComponents; ComponentLink2URL: https://datasheet.ciiva.com/1038/l0075s0083lqg15hs-1038118.pdf?src-supplier=Digi-Key; ComponentLink2Description: https://datasheet.ciiva.com/1038/l0075s0083lqg15hs-1038118.pdf?src-supplier=Digi-Key; ComponentLink3URL: https://datasheet.ciiva.com/1038/l0075s0083lqg15hs-1038119.pdf?src-supplier=Digi-Key; ComponentLink3Description: https://datasheet.ciiva.com/1038/l0075s0083lqg15hs-1038119.pdf?src-supplier=Digi-Key; ComponentLink4URL: https://datasheet.ciiva.com/17247/l0075s0083lqg15hs-17247110.pdf?src-supplier=Avnet+Europe; ComponentLink4Description: https://datasheet.ciiva.com/17247/l0075s0083lqg15hs-17247110.pdf?src-supplier=Avnet+Europe; ComponentLink5URL: https://datasheet.ciiva.com/1038/l0075s0083lqg15hs-1038120.pdf?src-supplier=Digi-Key; ComponentLink5Description: https://datasheet.ciiva.com/1038/l0075s0083lqg15hs-1038120.pdf?src-supplier=Digi-Key; ComponentLink6URL: https://datasheet.ciiva.com/8510/l0075s0083lqg15hs-8510813.pdf?src-supplier=Avnet; ComponentLink6Description: https://datasheet.ciiva.com/8510/l0075s0083lqg15hs-8510813.pdf?src-supplier=Avnet
L5 = CMP-06042-008294-1: Multilayer type RF Inductor 6.2nH ±0.3nH 0.2Ω 600mA 0402; Current Rating: 300mA; DC Resistance (DCR): 220mR; Shielding: Unshielded; Q Factor: 8; Test Frequency: 100MHz; Core Material: Air; Self Resonant Frequency: 4.5GHz; Width: 0.02inch; Length: 1mm; Height - Seated (Max): 0.022inch; Min Operating Temperature: -55°C; Case Code (Imperial): 0402; Case/Package: 0402; Termination: SMD/SMT; Max Operating Temperature: 125°C; Package Quantity: 10000; Depth: 0.55mm; Radiation Hardening: No; Lead Free: Lead Free; Packaging: Tape and Reel; Max DC Current: 300mA; Height: 0.5mm; Mount: Surface Mount; Military Standard: Not; Case Code (Metric): 1005; DC Current: 300mA
L6 = CMP-06042-003922-1: Multilayer type RF Inductor 6.8nH ±5% 0.22Ω 600mA 0402; Manufacturer: Murata; Q Factor: 8; DC Current: 300mA; Self Resonant Frequency: 4.5GHz; DC Resistance (DCR): 240mR; Test Frequency: 100MHz; Core Material: Air; Shielding: Unshielded; Height: 0.5mm; Max Operating Temperature: 125°C; Height - Seated (Max): 0.022inch; Lead Free: Lead Free; Package Quantity: 10000; Min Operating Temperature: -55°C; Case/Package: 0402; Radiation Hardening: No; Case Code (Imperial): 0402; Depth: 0.55mm; Termination: SMD/SMT; Width: 0.02inch; Current Rating: 300mA; Max DC Current: 300mA; Tolerance: 5%; Length: 1mm; Military Standard: Not; Mount: Surface Mount; Case Code (Metric): 1005; Packaging: Tape and Reel; Supplier 1: Mouser; Supplier Part Number 1: 81-LQG15HS6N8J02D; Manufacturer Part Number: LQG15HS6N8J02D; RoHS: Yes; Category: Fixed Inductors; Stock 1: 101137; Pricing 1: 1=0,10000, 10=0,05100, 50=0,05100, 100=0,04100, 500=0,03400, 1000=0,02900, 2500=0,02500, 10000=0,02100 (USD); Series: LQG15HS; Rated Current-Max: 300mA; RoHS Compliant: Yes; ComponentLink1URL: https://datasheet.ciiva.com/27054/1864441-27054320.pdf?src-supplier=Jameco; ComponentLink1Description: https://datasheet.ciiva.com/27054/1864441-27054320.pdf?src-supplier=Jameco; ComponentLink2URL: https://datasheet.ciiva.com/11799/0900766b8090d685-11799166.pdf?src-supplier=RSComponents; ComponentLink2Description: https://datasheet.ciiva.com/11799/0900766b8090d685-11799166.pdf?src-supplier=RSComponents; ComponentLink3URL: https://datasheet.ciiva.com/1038/l0075s0083lqg15hs-1038130.pdf?src-supplier=Digi-Key; ComponentLink3Description: https://datasheet.ciiva.com/1038/l0075s0083lqg15hs-1038130.pdf?src-supplier=Digi-Key; ComponentLink4URL: https://datasheet.ciiva.com/1038/l0075s0083lqg15hs-1038131.pdf?src-supplier=Digi-Key; ComponentLink4Description: https://datasheet.ciiva.com/1038/l0075s0083lqg15hs-1038131.pdf?src-supplier=Digi-Key; ComponentLink5URL: https://datasheet.ciiva.com/1038/l0075s0083lqg15hs-1038132.pdf?src-supplier=Digi-Key; ComponentLink5Description: https://datasheet.ciiva.com/1038/l0075s0083lqg15hs-1038132.pdf?src-supplier=Digi-Key; ComponentLink6URL: https://datasheet.ciiva.com/8509/l0075s0083lqg15hs-8509734.pdf?src-supplier=Avnet; ComponentLink6Description: https://datasheet.ciiva.com/8509/l0075s0083lqg15hs-8509734.pdf?src-supplier=Avnet; ComponentLink7URL: https://datasheet.ciiva.com/18089/getdatasheetpartid-106265-18089254.pdf?src-supplier=Verical; ComponentLink7Description: https://datasheet.ciiva.com/18089/getdatasheetpartid-106265-18089254.pdf?src-supplier=Verical; ComponentLink8URL: https://datasheet.ciiva.com/17279/l0075s0083lqg15hs-17279273.pdf?src-supplier=Avnet+Europe; ComponentLink8Description: https://datasheet.ciiva.com/17279/l0075s0083lqg15hs-17279273.pdf?src-supplier=Avnet+Europe; ComponentLink9URL: https://datasheet.ciiva.com/4977/o05e-4977131.pdf?src-supplier=Mouser; ComponentLink9Description: https://datasheet.ciiva.com/4977/o05e-4977131.pdf?src-supplier=Mouser; ComponentLink10URL: https://datasheet.ciiva.com/16213/l0075s0083lqg15hs-16213710.pdf?src-supplier=Future+Electronics; ComponentLink10Description: https://datasheet.ciiva.com/16213/l0075s0083lqg15hs-16213710.pdf?src-supplier=Future+Electronics
R31 R32 = CMP-1012-00623-3: Chip Resistor, 10 KOhm, +/- 1%, 0.1 W, -55 to 155 degC, 0603 (1608 Metric), RoHS, Tape and Reel; Manufacturer: Panasonic; Manufacturer Part Number: ERJ-3EKF1002V; Voltage Rating: 75V; Power Rating: 100mW; Temperature Coefficient: 100ppm\/degreesC; Case\/Package: 0603; Number of Pins: 2; Package Reference: 603; Depth: 0.8mm; Mount: SurfaceMount; Package Description: 2-Pin Surface Mount Device, Body 1.6 x 0.85 mm; Datasheet Version: 02/2017; Length: 1.6mm; Lead Free: LeadFree; Height: 0.45mm; Number of Terminations: 2; Max Power Dissipation: 100mW; Min Operating Temperature: -55degC; Datasheet URL: https://industrial.panasonic.com/cdbs/www-data/pdf/RDA0000/AOA0000C304.pdf; Termination: SMD/SMT; Case Code (Metric): 1608; Tolerance: 1%; Max Operating Temperature: 155degC; RoHSCompliant: true; Voltage Rating (DC): 75V; Radiation Hardening: No; Packaging: TapeandReel; Composition: ThickFilm; Mounting Technology: SurfaceMount; Manufacturer URL: http://www.panasonic.com/; Width: 0.031inch; REACH SVHC: NoSVHC; Contact Plating: Tin; Military Standard: Not; Package Quantity: 1; Supplier 1: Mouser; Supplier Part Number 1: 667-ERJ-3EKF1002V; RoHS: Yes; Category: Chip SMD Resistors; Stock 1: 20455; Pricing 1: 1=0,10000, 10=0,04000, 50=0,04000, 100=0,01700, 1000=0,00700, 5000=0,00500, 10000=0,00500 (USD); Case/Package: 0603; Size Code: 0603; Resistor Type: Thick Film; Series: ERJ; Resistance Tolerance: 1%; Construction: Rectangular; Features: Automotive AEC-Q200; Technology: THICK FILM; RoHS Compliant: Yes; ComponentLink1URL: https://datasheet.ciiva.com/16511/aoa0000ce2-16511861.pdf?src-supplier=Avnet+Asia; ComponentLink1Description: https://datasheet.ciiva.com/16511/aoa0000ce2-16511861.pdf?src-supplier=Avnet+Asia; ComponentLink2URL: https://datasheet.ciiva.com/46372/1678782-46372725.pdf?src-supplier=Element14; ComponentLink2Description: https://datasheet.ciiva.com/46372/1678782-46372725.pdf?src-supplier=Element14; ComponentLink3URL: https://datasheet.ciiva.com/28514/426256-28514198.pdf?src-supplier=Element14; ComponentLink3Description: https://datasheet.ciiva.com/28514/426256-28514198.pdf?src-supplier=Element14; ComponentLink4URL: https://datasheet.ciiva.com/9194/aoa0000ce2-9194199.pdf?src-supplier=Avnet; ComponentLink4Description: https://datasheet.ciiva.com/9194/aoa0000ce2-9194199.pdf?src-supplier=Avnet; ComponentLink5URL: https://datasheet.ciiva.com/7830/aoa0000ce2-7830729.pdf?src-supplier=Element14; ComponentLink5Description: https://datasheet.ciiva.com/7830/aoa0000ce2-7830729.pdf?src-supplier=Element14; ComponentLink6URL: https://datasheet.ciiva.com/17212/aoa0000ce2-17212105.pdf?src-supplier=Avnet+Europe; ComponentLink6Description: https://datasheet.ciiva.com/17212/aoa0000ce2-17212105.pdf?src-supplier=Avnet+Europe; ComponentLink7URL: https://datasheet.ciiva.com/30208/aoa0000ce2-30208985.pdf?src-supplier=Onlinecomponents.com; ComponentLink7Description: https://datasheet.ciiva.com/30208/aoa0000ce2-30208985.pdf?src-supplier=Onlinecomponents.com; ComponentLink8URL: https://datasheet.ciiva.com/48530/aoa0000ce2-48530988.pdf?src-supplier=Avnet; ComponentLink8Description: https://datasheet.ciiva.com/48530/aoa0000ce2-48530988.pdf?src-supplier=Avnet; ComponentLink9URL: https://datasheet.ciiva.com/24070/aoa0000ce2-24070318.pdf?src-supplier=Mouser; ComponentLink9Description: https://datasheet.ciiva.com/24070/aoa0000ce2-24070318.pdf?src-supplier=Mouser; ComponentLink10URL: https://datasheet.ciiva.com/16759/70260748-16759807.pdf?src-supplier=Allied+Electronics; ComponentLink10Description: https://datasheet.ciiva.com/16759/70260748-16759807.pdf?src-supplier=Allied+Electronics
R41 R42 = CMP-2100-03667-1: Chip Resistor, 0 Ohm, +/- 5%, 0.1 W, -55 to 155 degC, 0603 (1608 Metric), RoHS, Tape and Reel; Manufacturer: Yageo; Temperature Coefficient: 200ppm/degreesC; Voltage Rating: 50V; Power Rating: 100mW; Width: 0.8mm; Max Operating Temperature: 155degC; Tolerance: 5%; Package Reference: 0603; Height: 0.45mm; Depth: 0.8mm; Package Description: 2-Pin Surface Mount Device, Body 1.6 x 0.8 mm; Termination: SMD/SMT; Package Quantity: 5000; Case/Package: 0603; Radiation Hardening: No; Number of Pins: 2; Length: 1.6mm; Lead Free: LeadFree; Voltage Rating (DC): 50V; Military Standard: Not; Datasheet URL: http://www.yageo.com/NewPortal/yageodocoutput?fileName=/pdf/R-Chip/PYu-RC_Group_51_RoHS_L_5.pdf; Manufacturer URL: http://www.yageo.com/; Packaging: TapeandReel; Case Code (Metric): 1608; Min Operating Temperature: -55degC; Composition: ThickFilm; RoHSCompliant: true; Contact Plating: Tin; Datasheet Version: Rev. 5, 10/2016; REACH SVHC: NoSVHC
U11 = CMP-2000-05356-1: Low Power Long Range Transceiver, 137 to 1020 MHz, -40 to 85 degC, 28-Pin QFN, RoHS, Tape and Reel; Manufacturer: Semtech; Power - Output: 20dBm; Data Rate (Max): 300kbps; Sensitivity: -148dBm; Featured Product: SX1276LongRangeTransceiver; PCN Design/Specification: CopperWire25/Mar/2014; GPIO: 6; Frequency: 137MHz~1.02GHz; Voltage - Supply: 1.8V~3.7V; Protocol: LoRa™; Current - Transmitting: 20mA~120mA; Current - Receiving: 10.8mA~12mA; Online Catalog: SX1276,SX1277andSX1278; Design Resources: SX127xReferenceDesignOverviewDevelopmentToolSelector; Serial Interfaces: SPI; Mfg Application Notes: LoRaModulation:CrystalOscillatorGuidanceSX12xxSoftwareImplementationofDataWhiteningandCRCSX127xLoRaLowEnergyDesignGuideSX127xLoRaModemDesignersGuide; Modulation: FSK,GFSK,GMSK,MSK,OOK; Other Names: SX1276IMLTRTTR; Operating Supply Voltage: 3.7V; Series: -; Manufacturer URL: http://www.semtech.com/; Datasheet URL: http://www.semtech.com/images/datasheet/sx1276.pdf; Type: TxRx+MCU; RF Family/Standard: 802.15.4; Package Reference: QFN-28; Standard Package: 3,000; Package Description: 28-Pin Quad Flat No-lead Package, Body 6 x 6 mm, Pitch 0.65 mm; Category: RF/IFandRFID; Operating Temperature: -40degC~85degC; Datasheet Version: Rev. 4, 03/2015; Memory Size: -; Family: RFTransceiverICs; Packaging: Tape&Reel(TR); Package / Case: 28-VQFNExposedPad; Supplier 1: Mouser; Supplier Part Number 1: 947-SX1276IMLTRT; Manufacturer Part Number: SX1276IMLTRT; RoHS: Yes; Stock 1: 32; Pricing 1: 1=7,68000, 10=7,04000, 25=6,40000, 50=6,40000, 100=5,76000, 250=5,28000, 500=4,80000, 1000=4,76000, 3000=4,61000, 10000=4,61000 (USD); Case/Package: VQFN; Min Operating Temperature: -40°C; Max Operating Temperature: 85°C; Package Quantity: 3000; Data Rate: 300Kbps; Number of GPIO: 6; Interface: SPI; Lead Free: Lead Free; ComponentLink1URL: https://datasheet.ciiva.com/29635/sx1276-29635605.pdf?src-supplier=Digi-Key; ComponentLink1Description: https://datasheet.ciiva.com/29635/sx1276-29635605.pdf?src-supplier=Digi-Key; ComponentLink2URL: https://datasheet.ciiva.com/29635/sx1276-29635606.pdf?src-supplier=Digi-Key; ComponentLink2Description: https://datasheet.ciiva.com/29635/sx1276-29635606.pdf?src-supplier=Digi-Key; ComponentLink3URL: https://datasheet.ciiva.com/29635/sx1276-29635607.pdf?src-supplier=Digi-Key; ComponentLink3Description: https://datasheet.ciiva.com/29635/sx1276-29635607.pdf?src-supplier=Digi-Key
Y1 = ABM11-32.000MHZ-D2X-T3: Crystal or Oscillator; Manufacturer_Name: ABRACON; Datasheet Link: https://datasheet.datasheetarchive.com/originals/dk/DKDS-11/203423.pdf; Height: 0.59mm; Manufacturer_Part_Number: ABM11-32.000MHZ-D2X-T3; Mouser Part Number: 815-ABM11-32-D2XT3; Mouser Price/Stock: https://www.mouser.com/Search/Refine.aspx?Keyword=815-ABM11-32-D2XT3; Arrow Part Number: ABM11-32.000MHZ-D2X-T3; Arrow Price/Stock: https://www.arrow.com/en/products/abm11-32.000mhz-d2x-t3/abracon